# EasyEDA Pro project PicoMiteVGAV1.1.eprj

# Schematic Schematic1
Create Date: 2023-03-16; Page Name: P1; Project Name: PicoMiteVGAV1.1; Schematic Name: Schematic1; Update Date: 2023-06-09; Company: EasyEDA.com; Drawed: Peter Mather; Page Size: A4; Part Number: JLCPCB-002; Reviewed: Peter Mather; Version: V0.1
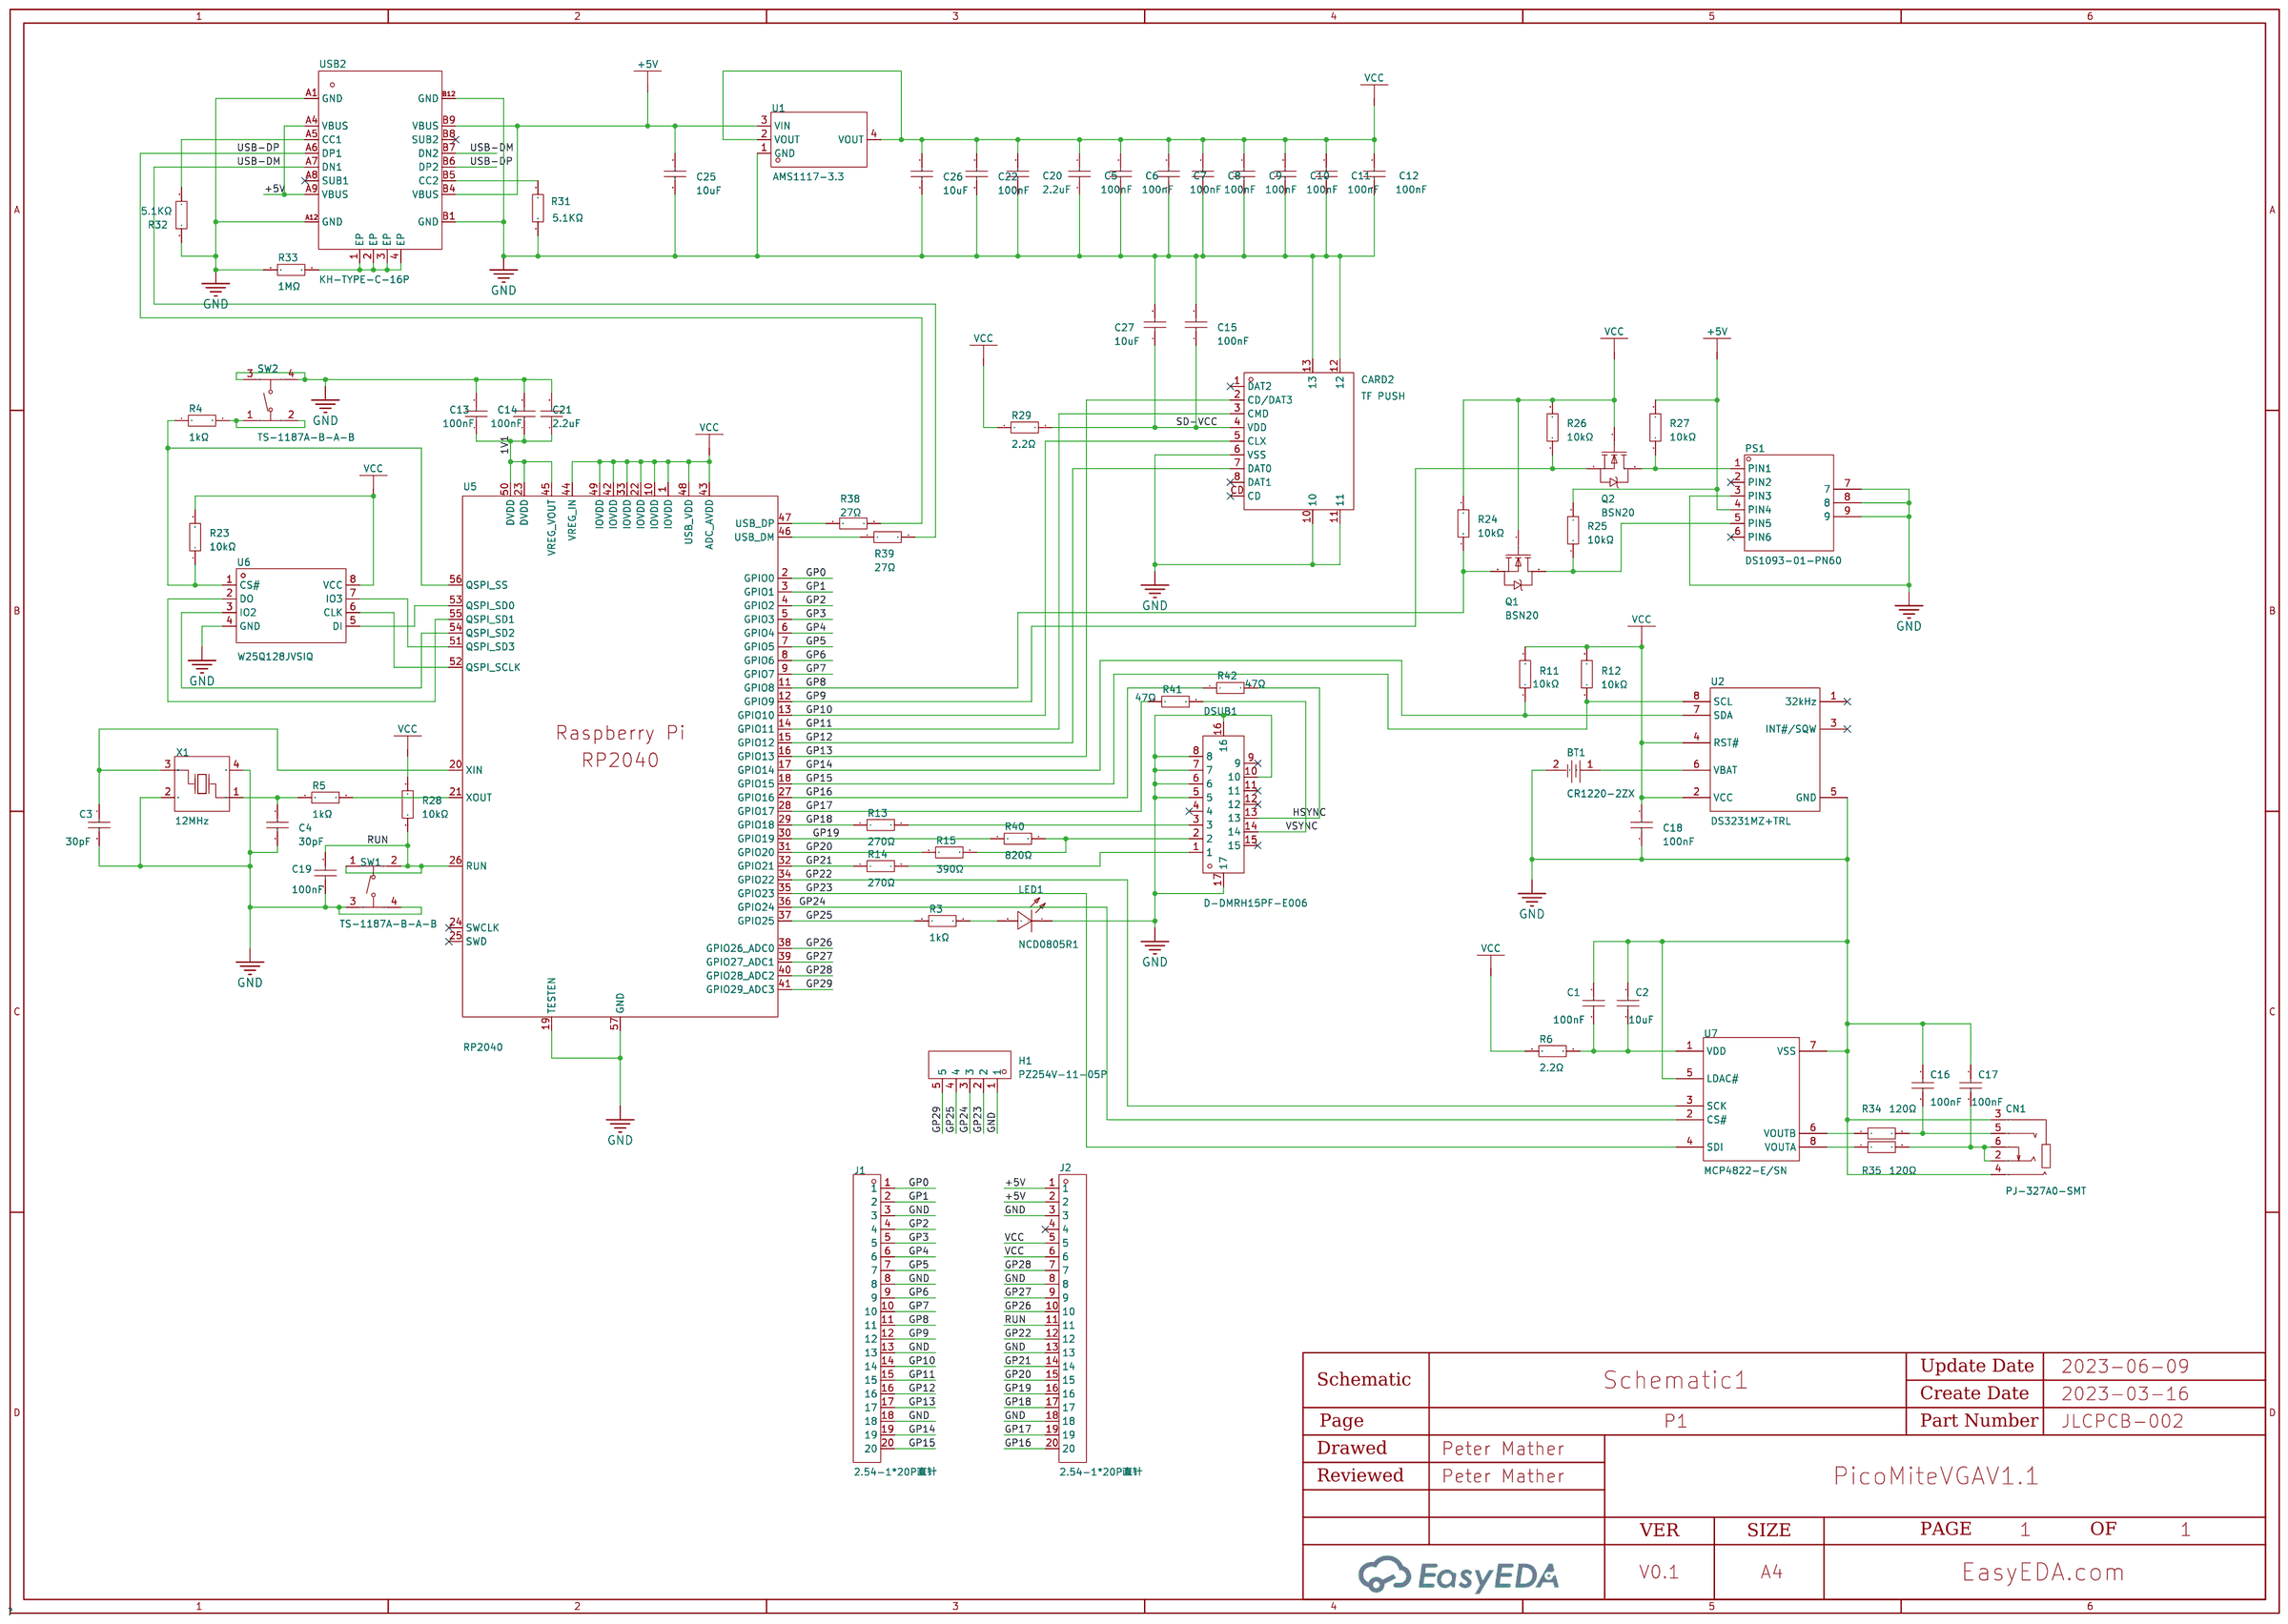
[diagram p0: schematic sheet]

## Parts
BT1  CR1220-2ZX  [BAT-SMD_CR1220-2ZX]
C1  100nF  [C0402_NEW]
C2  10uF  [C1206]
C3  30pF  [C0402]
C4  30pF  [C0402]
C5  100nF  [C0402_NEW]
C6  100nF  [C0402_NEW]
C7  100nF  [C0402_NEW]
C8  100nF  [C0402_NEW]
C9  100nF  [C0402_NEW]
C10  100nF  [C0402_NEW]
C11  100nF  [C0402_NEW]
C12  100nF  [C0402_NEW]
C13  100nF  [C0402_NEW]
C14  100nF  [C0402_NEW]
C15  100nF  [C0402_NEW]
C16  100nF  [C0402_NEW]
C17  100nF  [C0402_NEW]
C18  100nF  [C0402_NEW]
C19  100nF  [C0402_NEW]
C20  2.2uF  [C0603]
C21  2.2uF  [C0603]
C22  100nF  [C0402_NEW]
C25  10uF  [C1206]
C26  10uF  [C1206]
C27  10uF  [C1206]
CARD2  TF PUSH  [TF-SMD_TF-PUSH]
CN1  PJ-327A0-SMT  [AUDIO-SMD_PJ-327A0-SMT]
DSUB1  D-DMRH15PF-E006  [DSUB-TH_15P-P2.29-H-F_DDMRH15PFE006]
H1  PZ254V-11-05P  [HDR-TH_5P-P2.54-V-M]
J1  2.54-1*20P直针  [HDR-TH_20P-P2.54-V-M-1]
J2  2.54-1*20P直针  [HDR-TH_20P-P2.54-V-M-1]
LED1  NCD0805R1  [LED0805-RD]
PS1  DS1093-01-PN60  [CONN-TH_DS1093-01-PN60]
Q1  BSN20  [SOT-23-3_L2.9-W1.6-P1.90-LS2.8-BR]
Q2  BSN20  [SOT-23-3_L2.9-W1.6-P1.90-LS2.8-BR]
R3  1kΩ  [R0603]
R4  1kΩ  [R0603]
R5  1kΩ  [R0603]
R6  2.2Ω  [R0805]
R11  10kΩ  [R0805]
R12  10kΩ  [R0805]
R13  270Ω  [R0603]
R14  270Ω  [R0603]
R15  390Ω  [R0603]
R23  10kΩ  [R0402]
R24  10kΩ  [R0402]
R25  10kΩ  [R0402]
R26  10kΩ  [R0402]
R27  10kΩ  [R0402]
R28  10kΩ  [R0402]
R29  2.2Ω  [R0805]
R31  5.1kΩ  [R0402]
R32  5.1kΩ  [R0402]
R33  1MΩ  [R0402]
R34  120Ω  [R0603]
R35  120Ω  [R0603]
R38  27Ω  [R0603]
R39  27Ω  [R0603]
R40  820Ω  [R0603]
R41  47Ω  [R0805]
R42  47Ω  [R0805]
SW1  TS-1187A-B-A-B  [SW-SMD_4P-L5.1-W5.1-P3.70-LS6.5-TL-2]
SW2  TS-1187A-B-A-B  [SW-SMD_4P-L5.1-W5.1-P3.70-LS6.5-TL-2]
U1  AMS1117-3.3  [SOT-223-3_L6.5-W3.4-P2.30-LS7.0-BR]
U2  DS3231MZ+TRL  [SOIC-8_L4.9-W3.9-P1.27-LS6.0-BL]
U5  RP2040  [LQFN-56_L7.0-W7.0-P0.4-EP]
U6  W25Q128JVSIQ  [SOIC-8_L5.3-W5.3-P1.27-LS8.0-BL]
U7  MCP4822-E/SN  [SOIC-8_L4.9-W3.9-P1.27-LS6.0-BL]
USB2  KH-TYPE-C-16P  [USB-C-SMD_KH-TYPE-C-16P]
X1  12MHz  [OSC-SMD_4P-L3.2-W2.5-BL]

## Library data of the parts
BT1 = CR1220-2ZX: Connector Type:Battery base Battery Type:CR1220 Operating Temperature Range:-25℃~+85℃ Operating Temperature Range:-25℃~+85℃; LCSC Part Name: 电池底座 适用电池:CR1220 自吸; Supplier Part: C969906; Manufacturer: Q&J; Supplier Footprint: SMD; JLCPCB Part Class: Extended Part; Datasheet: https://atta.szlcsc.com/upload/public/pdf/source/20210107/C969906_C1D85B5C66CBBA4D1AEB8467FE1CEC7A.pdf; Supplier: LCSC; Connector Type: Battery base; Battery Type: CR1220; Operating Temperature Range: -25℃~+85℃
C1 C5-C19 C22 = CL05B104KO5NNNC: Capacitance: Tolerance:±10% Tolerance:±10% Voltage Rated: Temperature Coefficient:; LCSC Part Name: 100nF ±10% 16V; Supplier Part: C1525; Manufacturer: SAMSUNG(三星); Supplier Footprint: 0402; JLCPCB Part Class: Basic Part; Datasheet: https://atta.szlcsc.com/upload/public/pdf/source/20160103/1457707674891.pdf; Supplier: LCSC; Tolerance: ±10%
C2 C25-C27 = CL31A106KBHNNNE: Capacitance: Tolerance:±10% Tolerance:±10% Voltage Rated: Temperature Coefficient:; LCSC Part Name: 10uF ±10% 50V; Supplier Part: C13585; Manufacturer: SAMSUNG(三星); Supplier Footprint: 1206; JLCPCB Part Class: Basic Part; Datasheet: https://atta.szlcsc.com/upload/public/pdf/source/20160103/1457707668742.pdf; Supplier: LCSC; Tolerance: ±10%
C3 C4 = 0402CG300J500NT: Capacitance: Tolerance:±5% Tolerance:±5% Voltage Rated: Temperature Coefficient:; LCSC Part Name: 30pF ±5% 50V; Supplier Part: C1570; Manufacturer: FH(风华); Supplier Footprint: 0402; JLCPCB Part Class: Basic Part; Datasheet: https://atta.szlcsc.com/upload/public/pdf/source/20170923/C1570_1506149275948988377.pdf; Supplier: LCSC; Tolerance: ±5%
C20 C21 = CL10A225KO8NNNC: Capacitance: Tolerance:±10% Tolerance:±10% Voltage Rated: Temperature Coefficient:; LCSC Part Name: 2.2uF ±10% 16V; Supplier Part: C23630; Manufacturer: SAMSUNG(三星); Supplier Footprint: 0603; JLCPCB Part Class: Basic Part; Datasheet: https://atta.szlcsc.com/upload/public/pdf/source/20160103/1457707709512.pdf; Supplier: LCSC; Tolerance: ±10%
CARD2 = TF PUSH: Card Type:MicroSD卡(TF卡) Connector Type:卡座 Card Connection Mode:自弹式 Maximum Body Height:2mm Operating Temperature Range:-20℃~+90℃ Operating Temperature Range:-20℃~+90℃; LCSC Part Name: 自弹式TF卡座 TF外焊式内存卡卡座; Supplier Part: C393941; Manufacturer: SHOU HAN(首韩); Supplier Footprint: SMD; JLCPCB Part Class: Extended Part; Datasheet: https://atta.szlcsc.com/upload/public/pdf/source/20191011/C393941_0DDD896EE907FEB750D8B7B8982E2A67.pdf; Supplier: LCSC; Card Type: MicroSD卡(TF卡); Connector Type: 卡座; Card Connection Mode: 自弹式; Maximum Body Height: 2mm; Operating Temperature Range: -20℃~+90℃
CN1 = PJ-327A0-SMT: Connector Type:3.5mm耳机座 Current Rating (Max):0.5A Voltage Rating (Max):30V Operating Temperature Range:-20℃~+70℃ Operating Temperature Range:-20℃~+70℃ Welding Temperature (Max):235℃; LCSC Part Name: 3.5mm耳机座 5P镀金; Supplier Part: C381135; Manufacturer: XKB Connectivity(中国星坤); Supplier Footprint: SMD; JLCPCB Part Class: Extended Part; Datasheet: https://atta.szlcsc.com/upload/public/pdf/source/20211011/16B83D74DCFBFB52BBA1016D248FDA16.pdf; Supplier: LCSC; Connector Type: 3.5mm耳机座; Current Rating (Max): 0.5A; Voltage Rating (Max): 30V; Operating Temperature Range: -20℃~+70℃; Welding Temperature (Max): 235℃
DSUB1 = D-DMRH15PF-E006: Connector Type:D-Sub Gender:Female Number of Pins:15 Number of Rows:3 Mounting Style:Shrouded Current Rating (Max):3A Operating Temperature Range:-50℃~+105℃ Operating Temperature Range:-50℃~+105℃; LCSC Part Name: D-Sub 母 P数:15 HDR半金 铆合锁螺丝 黑胶芯三排; Supplier Part: C379814; Manufacturer: Ckmtw(灿科盟); Supplier Footprint: 插件; JLCPCB Part Class: Extended Part; Datasheet: https://atta.szlcsc.com/upload/public/pdf/source/20190517/C379814_DEECC6016DAC8F179B4364792A838A7A.pdf; Supplier: LCSC; Connector Type: D-Sub; Gender: Female; Number of Pins: 15; Number of Rows: 3; Mounting Style: Shrouded; Current Rating (Max): 3A; Operating Temperature Range: -50℃~+105℃
H1 = PZ254V-11-05P: Number of Rows:单排 Number of Pins:5 Pitch:2.54mm Pin Structure:1x5P Row Spacing:- Mounting Type:Straight Circluar Pins/Square Pins:Square Pins Current Rating (Max):- Voltage Rating (Max):- Length of Mating Pin:6mm Insulation Height:2.5mm Length of End Conn; LCSC Part Name: 2.54mm 1x5P 直插 方针; Supplier Part: C492404; Manufacturer: XFCN(兴飞); Supplier Footprint: 插件,P=2.54mm; JLCPCB Part Class: Extended Part; Datasheet: https://atta.szlcsc.com/upload/public/pdf/source/20200309/C492404_E51533260F8710EFF5D4617281164C1D.pdf; Supplier: LCSC; Number of Rows: 单排; Number of Pins: 5; Pitch: 2.54mm; Pin Structure: 1x5P; Mounting Type: Straight; Circluar Pins/Square Pins: Square Pins; Length of Mating Pin: 6mm; Insulation Height: 2.5mm; Length of End Connection Pin: 3mm; Operating Temperature Range: -40℃~+105℃; Color: Black
J1 J2 = 2.54-1*20P直针: Number of Rows:单排 Number of Pins:20 Pitch:2.54mm Pin Structure:1x20P Row Spacing:- Mounting Type:Straight Circluar Pins/Square Pins:Square Pins Current Rating (Max):3A Voltage Rating (Max):- Length of Mating Pin:- Insulation Height:- Length of End Connect; LCSC Part Name: 2.54mm 1x20P 直插 方针; Supplier Part: C50981; Manufacturer: BOOMELE(博穆精密); Supplier Footprint: 插件,P=2.54mm; JLCPCB Part Class: Extended Part; Datasheet: https://atta.szlcsc.com/upload/public/pdf/source/20151109/1457707571495.pdf; Supplier: LCSC; Number of Rows: 单排; Number of Pins: 20; Pitch: 2.54mm; Pin Structure: 1x20P; Mounting Type: Straight; Circluar Pins/Square Pins: Square Pins; Current Rating (Max): 3A; Operating Temperature Range: -40℃~+105℃; Color: Black
LED1 = NCD0805R1_C84256: Emitted Color:红灯; LCSC Part Name: 红灯; Supplier Part: C84256; Manufacturer: 国星光电; Supplier Footprint: 0805; JLCPCB Part Class: Basic Part; Datasheet: https://atta.szlcsc.com/upload/public/pdf/source/20200820/C84256_F0A75A43B3EAD75808600A0514C76B99.pdf; Supplier: LCSC; Emitted Color: 红灯
PS1 = DS1093-01-PN60: Number of Pins:6 Gender:Female Level of Protection:- Current Rating (Max):1A Operating Temperature Range:-40℃~+105℃ Operating Temperature Range:-40℃~+105℃; LCSC Part Name: PS2鼠标插座 6Pin  紫色; Supplier Part: C77848; Manufacturer: CONNFLY; Supplier Footprint: 插件; JLCPCB Part Class: Extended Part; Datasheet: https://atta.szlcsc.com/upload/public/pdf/source/20160816/1471343007546.pdf; Supplier: LCSC; Number of Pins: 6; Gender: Female; Current Rating (Max): 1A; Operating Temperature Range: -40℃~+105℃
Q1 Q2 = BSN20_C116157: Type: Drain Source Voltage (Vdss): Continuous Drain Current (Id): Power Dissipation (Pd):- Drain Source On Resistance (RDS(on)@Vgs,Id):3.5Ω@5V,200mA Gate Threshold Voltage (Vgs(th)@Id):1.5V@1mA; LCSC Part Name: N沟道 50V 100mA; Supplier Part: C116157; Manufacturer: SHIKUES(时科); Supplier Footprint: SOT-23-3L; JLCPCB Part Class: Extended Part; Datasheet: https://atta.szlcsc.com/upload/public/pdf/source/20170721/C116157_1500622630262834583.pdf; Supplier: LCSC; Drain Source On Resistance (RDS(on)@Vgs,Id): 3.5Ω@5V,200mA; Gate Threshold Voltage (Vgs(th)@Id): 1.5V@1mA
R3-R5 = 0603WAF1001T5E: Type:Thick Film Resistors Resistance: Tolerance:±1% Tolerance:±1% Power(Watts): Temperature Coefficient:±100ppm/℃ Temperature Coefficient:±100ppm/℃ Overload Voltage (Max): Operating Temperature Range:-55℃~+155℃ Operating Temperature Range:-55℃~+155℃; LCSC Part Name: 1kΩ ±1% 100mW; Supplier Part: C21190; Manufacturer: UNI-ROYAL(厚声); Supplier Footprint: 0603; JLCPCB Part Class: Basic Part; Datasheet: https://atta.szlcsc.com/upload/public/pdf/source/20200306/C422600_1E6D84923E4A46A82E41ADD87F860B5C.pdf; Supplier: LCSC; Type: Thick Film Resistors; Tolerance: ±1%; Temperature Coefficient: ±100ppm/℃; Operating Temperature Range: -55℃~+155℃
R6 R29 = 0805W8F220KT5E: LCSC Part Name: 2.2Ω(2R20) ±1% 编带; Supplier Part: C17521; Manufacturer: UNI-ROYAL(厚声); Supplier Footprint: 0805; JLCPCB Part Class: Basic Part; Datasheet: https://atta.szlcsc.com/upload/public/pdf/source/20170920/C17521_1505887118343979880.pdf; Supplier: LCSC
R11 R12 = 0805W8F1002T5E: Type:Thick Film Resistors Resistance: Tolerance:±1% Tolerance:±1% Power(Watts): Temperature Coefficient:±100ppm/℃ Temperature Coefficient:±100ppm/℃ Overload Voltage (Max): Operating Temperature Range:-55℃~+155℃ Operating Temperature Range:-55℃~+155℃; LCSC Part Name: 10kΩ ±1% 125mW; Supplier Part: C17414; Manufacturer: UNI-ROYAL(厚声); Supplier Footprint: 0805; JLCPCB Part Class: Basic Part; Datasheet: https://atta.szlcsc.com/upload/public/pdf/source/20200306/C422600_1E6D84923E4A46A82E41ADD87F860B5C.pdf; Supplier: LCSC; Type: Thick Film Resistors; Tolerance: ±1%; Temperature Coefficient: ±100ppm/℃; Operating Temperature Range: -55℃~+155℃
R13 R14 = 0603WAF2700T5E: Type:Thick Film Resistors Resistance: Tolerance:±1% Tolerance:±1% Power(Watts): Temperature Coefficient:±100ppm/℃ Temperature Coefficient:±100ppm/℃ Overload Voltage (Max): Operating Temperature Range:-55℃~+155℃ Operating Temperature Range:-55℃~+155℃; LCSC Part Name: 270Ω ±1% 100mW; Supplier Part: C22966; Manufacturer: UNI-ROYAL(厚声); Supplier Footprint: 0603; JLCPCB Part Class: Basic Part; Datasheet: https://atta.szlcsc.com/upload/public/pdf/source/20200306/C422600_1E6D84923E4A46A82E41ADD87F860B5C.pdf; Supplier: LCSC; Type: Thick Film Resistors; Tolerance: ±1%; Temperature Coefficient: ±100ppm/℃; Operating Temperature Range: -55℃~+155℃
R15 = 0603WAF3900T5E: Tolerance: Temperature Coefficient: Temperature Coefficient: Power(Watts): Resistance: Overload Voltage (Max): Operating Temperature Range: Operating Temperature Range:; LCSC Part Name: 390Ω ±1%; Supplier Part: C23151; Manufacturer: UNI-ROYAL(厚声); Supplier Footprint: 0603; JLCPCB Part Class: Basic Part; Datasheet: https://atta.szlcsc.com/upload/public/pdf/source/20170920/C23151_1505901103965982535.pdf; Supplier: LCSC
R23-R28 = 0402WGF1002TCE: Type:Thick Film Resistors Resistance: Tolerance:±1% Tolerance:±1% Power(Watts): Temperature Coefficient:±100ppm/℃ Temperature Coefficient:±100ppm/℃ Overload Voltage (Max): Operating Temperature Range:-55℃~+155℃ Operating Temperature Range:-55℃~+155℃; LCSC Part Name: 10kΩ ±1% 62.5mW; Supplier Part: C25744; Manufacturer: UNI-ROYAL(厚声); Supplier Footprint: 0402; JLCPCB Part Class: Basic Part; Datasheet: https://atta.szlcsc.com/upload/public/pdf/source/20200306/C422600_1E6D84923E4A46A82E41ADD87F860B5C.pdf; Supplier: LCSC; Type: Thick Film Resistors; Tolerance: ±1%; Temperature Coefficient: ±100ppm/℃; Operating Temperature Range: -55℃~+155℃
R31 R32 = 0402WGF5101TCE: Type:Thick Film Resistors Resistance: Tolerance:±1% Tolerance:±1% Power(Watts): Temperature Coefficient:±100ppm/℃ Temperature Coefficient:±100ppm/℃ Overload Voltage (Max): Operating Temperature Range:-55℃~+155℃ Operating Temperature Range:-55℃~+155℃; LCSC Part Name: 5.1KΩ(5101) ±1% 编带; Supplier Part: C25905; Manufacturer: UNI-ROYAL(厚声); Manufacturer Part: 5.1KΩ; Supplier Footprint: 0402; JLCPCB Part Class: Basic Part; Datasheet: https://atta.szlcsc.com/upload/public/pdf/source/20170920/C25905_1505895107382980911.pdf; Supplier: LCSC; Type: Thick Film Resistors; Tolerance: ±1%; Temperature Coefficient: ±100ppm/℃; Operating Temperature Range: -55℃~+155℃
R33 = 0402WGF1004TCE: Type:Thick Film Resistors Resistance: Tolerance:±1% Tolerance:±1% Power(Watts): Temperature Coefficient:±100ppm/℃ Temperature Coefficient:±100ppm/℃ Overload Voltage (Max): Operating Temperature Range:-55℃~+155℃ Operating Temperature Range:-55℃~+155℃; LCSC Part Name: 1MΩ ±1% 62.5mW; Supplier Part: C26083; Manufacturer: UNI-ROYAL(厚声); Supplier Footprint: 0402; JLCPCB Part Class: Basic Part; Datasheet: https://atta.szlcsc.com/upload/public/pdf/source/20200306/C422600_1E6D84923E4A46A82E41ADD87F860B5C.pdf; Supplier: LCSC; Type: Thick Film Resistors; Tolerance: ±1%; Temperature Coefficient: ±100ppm/℃; Operating Temperature Range: -55℃~+155℃
R34 R35 = 0603WAF1200T5E: Type:Thick Film Resistors Resistance: Tolerance:±1% Tolerance:±1% Power(Watts): Temperature Coefficient:±100ppm/℃ Temperature Coefficient:±100ppm/℃ Overload Voltage (Max): Operating Temperature Range:-55℃~+155℃ Operating Temperature Range:-55℃~+155℃; LCSC Part Name: 120Ω ±1% 100mW; Supplier Part: C22787; Manufacturer: UNI-ROYAL(厚声); Supplier Footprint: 0603; JLCPCB Part Class: Basic Part; Datasheet: https://atta.szlcsc.com/upload/public/pdf/source/20200306/C422600_1E6D84923E4A46A82E41ADD87F860B5C.pdf; Supplier: LCSC; Type: Thick Film Resistors; Tolerance: ±1%; Temperature Coefficient: ±100ppm/℃; Operating Temperature Range: -55℃~+155℃
R38 R39 = 0603WAF270JT5E: Type:Thick Film Resistors Resistance: Tolerance:±1% Tolerance:±1% Power(Watts): Temperature Coefficient:±200ppm/℃ Temperature Coefficient:±200ppm/℃ Overload Voltage (Max): Operating Temperature Range:-55℃~+155℃ Operating Temperature Range:-55℃~+155℃; LCSC Part Name: 27Ω ±1% 100mW; Supplier Part: C25190; Manufacturer: UNI-ROYAL(厚声); Supplier Footprint: 0603; JLCPCB Part Class: Basic Part; Datasheet: https://atta.szlcsc.com/upload/public/pdf/source/20200306/C422600_1E6D84923E4A46A82E41ADD87F860B5C.pdf; Supplier: LCSC; Type: Thick Film Resistors; Tolerance: ±1%; Temperature Coefficient: ±200ppm/℃; Operating Temperature Range: -55℃~+155℃
R40 = 0603WAF8200T5E: Type:Thick Film Resistors Resistance: Tolerance:±1% Tolerance:±1% Power(Watts): Temperature Coefficient:±100ppm/℃ Temperature Coefficient:±100ppm/℃ Overload Voltage (Max): Operating Temperature Range:-55℃~+155℃ Operating Temperature Range:-55℃~+155℃; LCSC Part Name: 820Ω ±1% 100mW; Supplier Part: C23253; Manufacturer: UNI-ROYAL(厚声); Supplier Footprint: 0603; JLCPCB Part Class: Basic Part; Datasheet: https://atta.szlcsc.com/upload/public/pdf/source/20200306/C422600_1E6D84923E4A46A82E41ADD87F860B5C.pdf; Supplier: LCSC; Type: Thick Film Resistors; Tolerance: ±1%; Temperature Coefficient: ±100ppm/℃; Operating Temperature Range: -55℃~+155℃
R41 R42 = 0805W8F470JT5E: Type:Thick Film Resistors Resistance: Tolerance:±1% Tolerance:±1% Power(Watts): Temperature Coefficient:±200ppm/℃ Temperature Coefficient:±200ppm/℃ Overload Voltage (Max): Operating Temperature Range:-55℃~+155℃ Operating Temperature Range:-55℃~+155℃; LCSC Part Name: 47Ω ±1% 125mW; Supplier Part: C17714; Manufacturer: UNI-ROYAL(厚声); Supplier Footprint: 0805; JLCPCB Part Class: Basic Part; Datasheet: https://atta.szlcsc.com/upload/public/pdf/source/20200306/C422600_1E6D84923E4A46A82E41ADD87F860B5C.pdf; Supplier: LCSC; Type: Thick Film Resistors; Tolerance: ±1%; Temperature Coefficient: ±200ppm/℃; Operating Temperature Range: -55℃~+155℃
SW1 SW2 = TS-1187A-B-A-B: Contact Current:50mA Voltage Rating (DC):12V Insulation Resistance:- Circuit:SPST Mounting Style:Brick nogging Actuator Style:Round Button Actuator/Cap Color:金色 With Lamp:No Operating Force:160gf Mechanical Life:100000 Operating Temperature:-30℃~+85℃ Oper; LCSC Part Name: 5.1*5.1*1.5 防水金属头160gf; Supplier Part: C318884; Manufacturer: XKB Connectivity(中国星坤); Supplier Footprint: SMD; JLCPCB Part Class: Basic Part; Datasheet: https://atta.szlcsc.com/upload/public/pdf/source/20200227/C318884_1F20165719E1C4CAA3E10C4C359C6E26.pdf; Supplier: LCSC; Contact Current: 50mA; Voltage Rating (DC): 12V; Circuit: SPST; Mounting Style: Brick nogging; Actuator Style: Round Button; Actuator/Cap Color: 金色; With Lamp: No; Operating Force: 160gf; Mechanical Life: 100000; Operating Temperature: -30℃~+85℃; Switch Length: 5.1mm; Switch Width: 5.1mm; Switch Height: 1.5mm; Strike Gundam: NO
U1 = AMS1117-3.3_C6186: Output Type: Output Polarity:Positive Number of Outputs:1 Maximum Input Voltage:- Output Voltage:3.3V~3.3V Output Voltage:3.3V~3.3V Dropout Voltage:1.3V@(800mA) Quiescent Current (Ground Current):- Output Current:1A Power Supply Rejection Ratio (PSRR):72d; LCSC Part Name: 正 Vout=3.3V 1A 72dB@(120Hz); Supplier Part: C6186; Manufacturer: AMS; Supplier Footprint: SOT-223-3; JLCPCB Part Class: Basic Part; Datasheet: https://atta.szlcsc.com/upload/public/pdf/source/20180727/C6186_7A095716F0823C02F1997A905E26C086.pdf; Supplier: LCSC; Output Polarity: Positive; Number of Outputs: 1; Output Voltage: 3.3V~3.3V; Dropout Voltage: 1.3V@(800mA); Output Current: 1A; Power Supply Rejection Ratio (PSRR): 72dB@(120Hz)
U2 = DS3231MZ+TRL: LCSC Part Name: DS3231MZRL; Supplier Part: C107410; Manufacturer: MAXIM(美信); Supplier Footprint: SOIC-8-150mil; JLCPCB Part Class: Extended Part; Datasheet: https://atta.szlcsc.com/upload/public/pdf/source/20170620/1497944726830.pdf; Supplier: LCSC
U5 = RP2040_C2040: CPU Core:ARM Cortex-M0 CPU Maximum Speed:133MHz Operating Voltage Range:- Operating Voltage Range:- Program Storage Size:- Program Memory Type:- RAM Size:264KB EEPROM:- GPIO Ports Number:30 ADC (Bit):12bit DAC (Bit):- PWM (Bit):- 8Bit Timer:- 16Bit Timer:; LCSC Part Name: ARM Cortex-M0 133MHz; Supplier Part: C2040; Manufacturer: Raspberry Pi(树莓派); Supplier Footprint: LQFN-56(7x7); JLCPCB Part Class: Extended Part; Datasheet: https://atta.szlcsc.com/upload/public/pdf/source/20210621/C2040_96F425825606B7957D87DD32E2512CA9.pdf; Supplier: LCSC; CPU Core: ARM Cortex-M0; CPU Maximum Speed: 133MHz; RAM Size: 264KB; GPIO Ports Number: 30; ADC (Bit): 12bit; UART/USART: 2; I2C: 2; SPI: 2; Universal Serial Bus: 有; Peripheral/Function: DMA；PWM; Direct Memory Access: 有
U6 = W25Q128JVSIQ: Supplier Part: C97521; Manufacturer: WINBOND(华邦); Supplier Footprint: SOIC-8-208mil; JLCPCB Part Class: Basic Part; Datasheet: https://atta.szlcsc.com/upload/public/pdf/source/20170316/1489627409956.pdf; Supplier: LCSC
U7 = MCP4822-E/SN: Supplier Part: C16040; Manufacturer: MICROCHIP(美国微芯); Supplier Footprint: SOIC-8; JLCPCB Part Class: Extended Part; Datasheet: https://atta.szlcsc.com/upload/public/pdf/source/20140724/1457707160793.pdf; Supplier: LCSC
USB2 = KH-TYPE-C-16P: Connector Type:Type-C Standard:- Gender:Female Number of Contacts:16 Number of Ports:1 Mounting Style:Surface Mount Current Rating - Power (Max):3A Operating Temperature Range:-40℃~+85℃ Operating Temperature Range:-40℃~+85℃; LCSC Part Name: Type-C 母座 卧贴; Supplier Part: C709357; Manufacturer: kinghelm(金航标); Supplier Footprint: SMD; JLCPCB Part Class: Extended Part; Datasheet: https://atta.szlcsc.com/upload/public/pdf/source/20200911/C709357_AA8DCEB38BB20E3035A7ED7AE7667837.pdf; Supplier: LCSC; Connector Type: Type-C; Gender: Female; Number of Contacts: 16; Number of Ports: 1; Mounting Style: Surface Mount; Current Rating - Power (Max): 3A; Operating Temperature Range: -40℃~+85℃
X1 = X322512MSB4SI: Crystal Type:SMD Crystal Resonator Frequency: Frequency Tolerance:±10ppm Frequency Tolerance:±10ppm Frequency Stability:±30ppm Frequency Stability:±30ppm Load Capacitance: Operating Temperature: Operating Temperature:; LCSC Part Name: 12MHz ±10ppm 20pF; Supplier Part: C9002; Manufacturer: YXC(扬兴晶振); Supplier Footprint: SMD3225-4P; JLCPCB Part Class: Basic Part; Datasheet: https://atta.szlcsc.com/upload/public/pdf/source/20210329/C112971_1F611BDC486E193C1706F6D8EB5AA189.pdf; Supplier: LCSC; Crystal Type: SMD Crystal Resonator; Frequency Tolerance: ±10ppm; Frequency Stability: ±30ppm

## Nets
1V1: C13.1 C14.1 C21.1 U5.23(DVDD) U5.45(VREG_VOUT) U5.50(DVDD)
+5V: C25.2 J2.1 J2.2 PS1.4(PIN4) R25.2 R27.2 U1.3(VIN) USB2.A4(VBUS) USB2.A9(VBUS) USB2.B4(VBUS) USB2.B9(VBUS)
GND: BT1.2 C1.2 C2.2 C3.1 C4.1 C5.1 C6.1 C7.1 C8.1 C9.1 C10.1 C11.1 C12.1 C13.2 C14.2 C15.2 C16.2 C17.2 C18.1 C19.1 C20.1 C21.2 C22.1 C25.1 C26.1 C27.2 CARD2.6(VSS) CARD2.10 CARD2.11 CARD2.12 CARD2.13 CN1.3 CN1.4 DSUB1.5 DSUB1.6 DSUB1.7 DSUB1.8 DSUB1.10 DSUB1.16 DSUB1.17 H1.1 J1.3 J1.8 J1.13 J1.18 J2.3 J2.8 J2.13 J2.18 LED1.1(-) PS1.3(PIN3) PS1.7 PS1.8 PS1.9 R31.1 R32.1 R33.1 SW1.3(C) SW1.4(D) SW2.3(C) SW2.4(D) U1.1(GND) U2.5(GND) U5.19(TESTEN) U5.57(GND) U6.4(GND) U7.5(LDAC#) U7.7(VSS) USB2.A1(GND) USB2.A12(GND) USB2.B1(GND) USB2.B12(GND) X1.2(GND) X1.4(GND)
VCC: C5.2 C6.2 C7.2 C8.2 C9.2 C10.2 C11.2 C12.2 C18.2 C20.2 C22.2 C26.2 J2.5 J2.6 Q1.1(G) Q2.1(G) R6.1 R11.2 R12.2 R23.2 R24.2 R26.2 R28.2 R29.1 U1.2(VOUT) U1.4(VOUT) U2.2(VCC) U2.4(RST#) U5.1(IOVDD) U5.10(IOVDD) U5.22(IOVDD) U5.33(IOVDD) U5.42(IOVDD) U5.43(ADC_AVDD) U5.44(VREG_IN) U5.48(USB_VDD) U5.49(IOVDD) U6.8(VCC)
GP0: J1.1 U5.2(GPIO0)
GP1: J1.2 U5.3(GPIO1)
GP2: J1.4 U5.4(GPIO2)
GP3: J1.5 U5.5(GPIO3)
GP4: J1.6 U5.6(GPIO4)
GP5: J1.7 U5.7(GPIO5)
GP6: J1.9 U5.8(GPIO6)
GP7: J1.10 U5.9(GPIO7)
GP8: J1.11 Q1.2(S) R24.1 U5.11(GPIO8)
GP9: J1.12 Q2.2(S) R26.1 U5.12(GPIO9)
GP10: CARD2.5(CLX) J1.14 U5.13(GPIO10)
GP11: CARD2.3(CMD) J1.15 U5.14(GPIO11)
GP12: CARD2.7(DAT0) J1.16 U5.15(GPIO12)
GP13: CARD2.2(CD/DAT3) J1.17 U5.16(GPIO13)
GP14: J1.19 R11.1 U2.7(SDA) U5.17(GPIO14)
GP15: J1.20 R12.1 U2.8(SCL) U5.18(GPIO15)
GP16: J2.20 R42.1 U5.27(GPIO16)
GP17: J2.19 R41.1 U5.28(GPIO17)
GP18: J2.17 R13.1 U5.29(GPIO18)
GP19: J2.16 R40.1 U5.30(GPIO19)
GP20: J2.15 R15.1 U5.31(GPIO20)
GP21: J2.14 R14.1 U5.32(GPIO21)
GP22: J2.12 U5.34(GPIO22) U7.3(SCK)
GP23: H1.2 U5.35(GPIO23) U7.4(SDI)
GP24: H1.3 U5.36(GPIO24) U7.2(CS#)
GP25: H1.4 R3.1 U5.37(GPIO25)
GP26: J2.10 U5.38(GPIO26_ADC0)
GP27: J2.9 U5.39(GPIO27_ADC1)
GP28: J2.7 U5.40(GPIO28_ADC2)
GP29: H1.5 U5.41(GPIO29_ADC3)
HSYNC: DSUB1.13 R42.2
RUN: C19.2 J2.11 R28.1 SW1.1(A) SW1.2(B) U5.26(RUN)
SD-VCC: C15.1 C27.1 CARD2.4(VDD) R29.2
USB-DM: R39.2 USB2.A7(DN1) USB2.B7(DN2)
USB-DP: R38.2 USB2.A6(DP1) USB2.B6(DP2)
VSYNC: DSUB1.14 R41.2
$1N15506: R39.1 U5.46(USB_DM)
$1N15528: R38.1 U5.47(USB_DP)
$1N16226: DSUB1.2 R15.2 R40.2
$1N16303: DSUB1.3 R13.2
$1N16324: DSUB1.1 R14.2
$1N17160: U5.52(QSPI_SCLK) U6.6(CLK)
$1N17190: U5.51(QSPI_SD3) U6.7(IO3)
$1N17220: U5.54(QSPI_SD2) U6.3(IO2)
$1N17286: U5.55(QSPI_SD1) U6.2(DO)
$1N17350: R4.1 R23.1 U5.56(QSPI_SS) U6.1(CS#)
$1N17556: U5.53(QSPI_SD0) U6.5(DI)
$1N17761: R5.2 U5.21(XOUT)
$1N17798: C4.2 R5.1 X1.1(OSC1)
$1N18648: C3.2 U5.20(XIN) X1.3(OSC2)
$1N19413: R4.2 SW2.1(A) SW2.2(B)
$1N20967: PS1.1(PIN1) Q2.3(D) R27.1
$1N21008: PS1.5(PIN5) Q1.3(D) R25.1
$1N25166: LED1.2(+) R3.2
$1N34038: BT1.1 U2.6(VBAT)
$1N89274: R31.2 USB2.B5(CC2)
$1N89558: R32.2 USB2.A5(CC1)
$1N90266: R33.2 USB2.1(EP) USB2.2(EP) USB2.3(EP) USB2.4(EP)
$1N147884: C1.1 C2.1 R6.2 U7.1(VDD)
$1N151381: R34.1 U7.6(VOUTB)
$1N151496: R35.1 U7.8(VOUTA)
$1N151611: C16.1 CN1.5 R34.2
$1N151726: C17.1 CN1.2 CN1.6 R35.2

Not connected (* = marked no-connect by the designer): CARD2 1(DAT2)* 8(DAT1)* CD*; DSUB1 4* 9* 11* 12* 15*; J2 4*; PS1 2(PIN2)* 6(PIN6)*; U2 1(32kHz)* 3(INT#/SQW)*; U5 24(SWCLK)* 25(SWD)*; USB2 A8(SUB1)* B8(SUB2)*

# Board PCB3
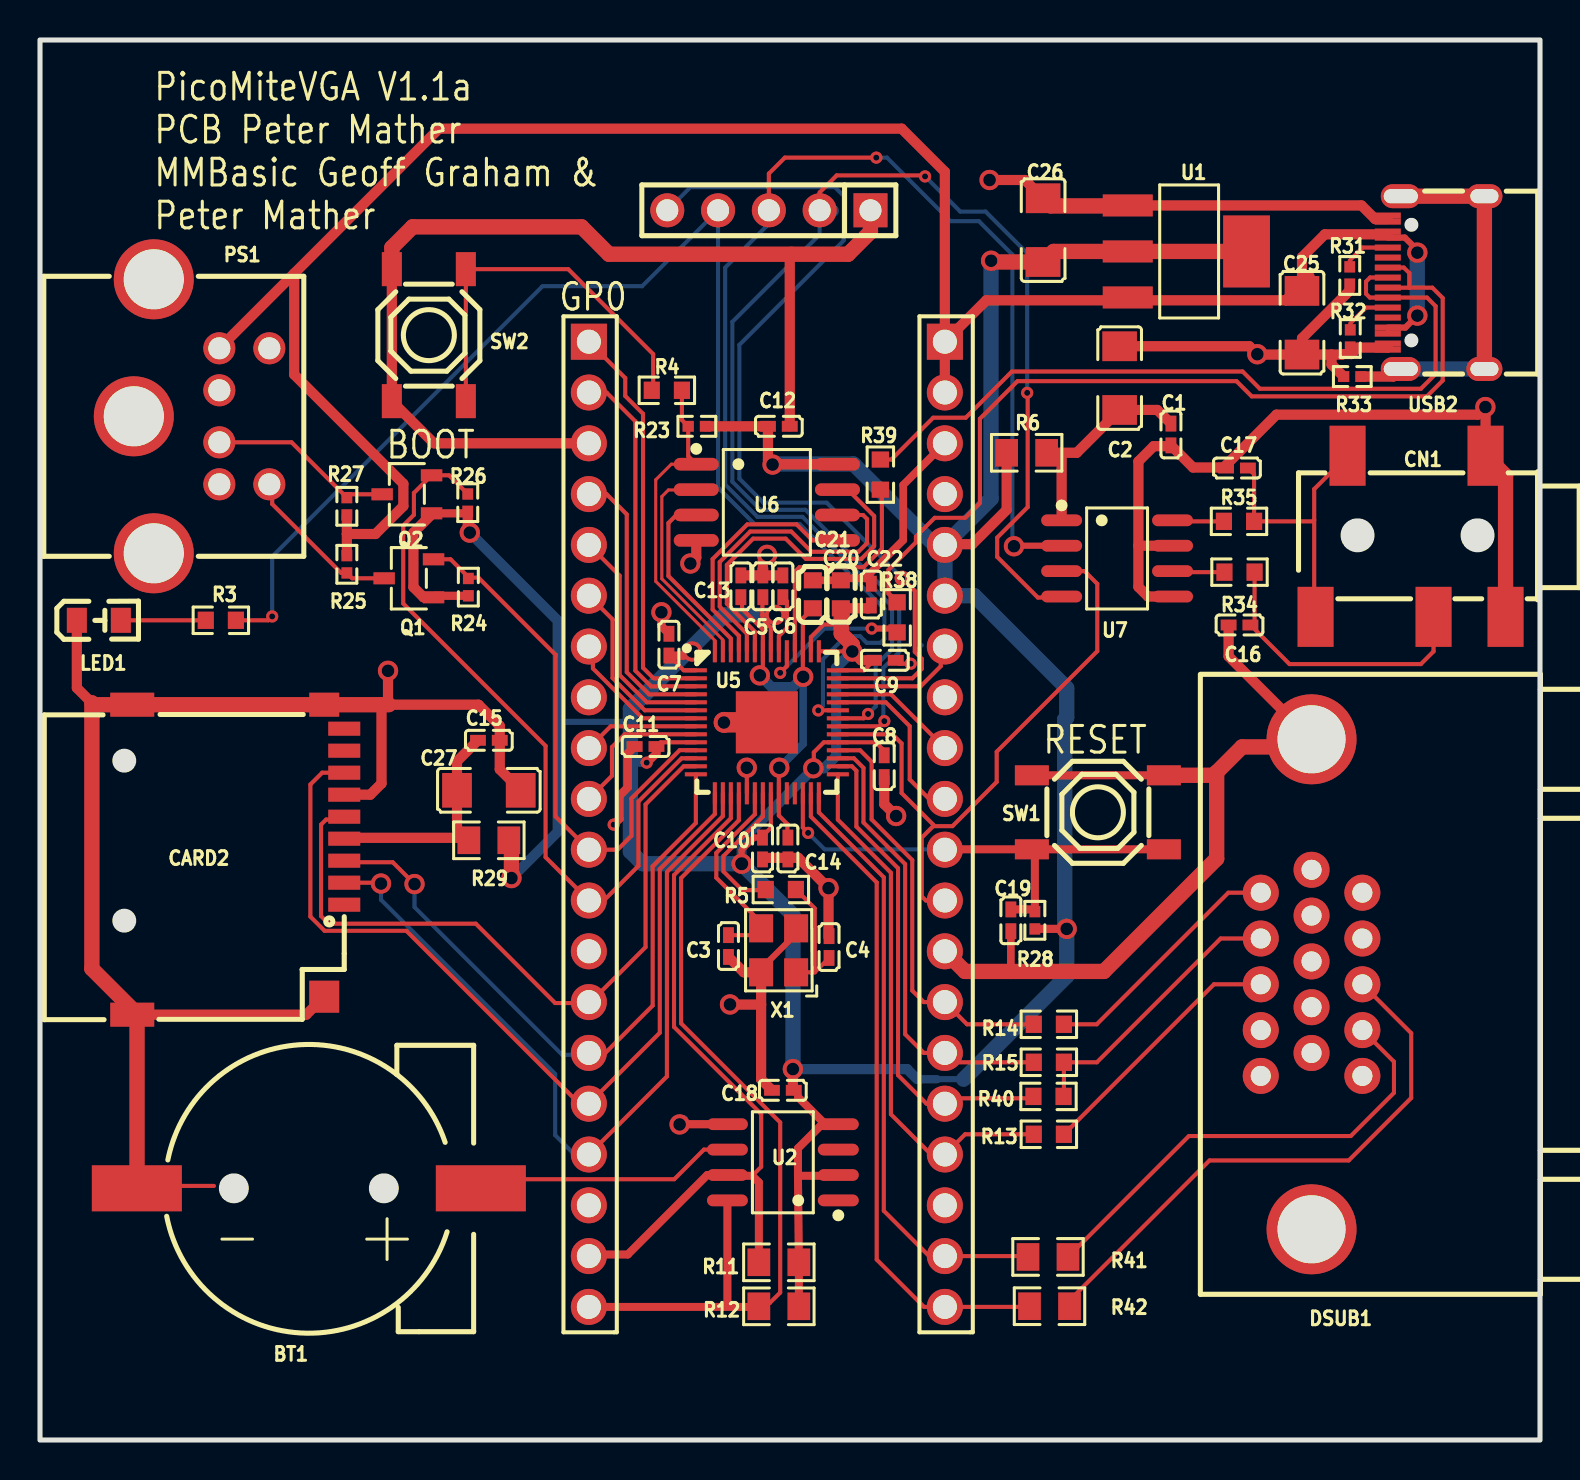
[diagram p1: board, top side]
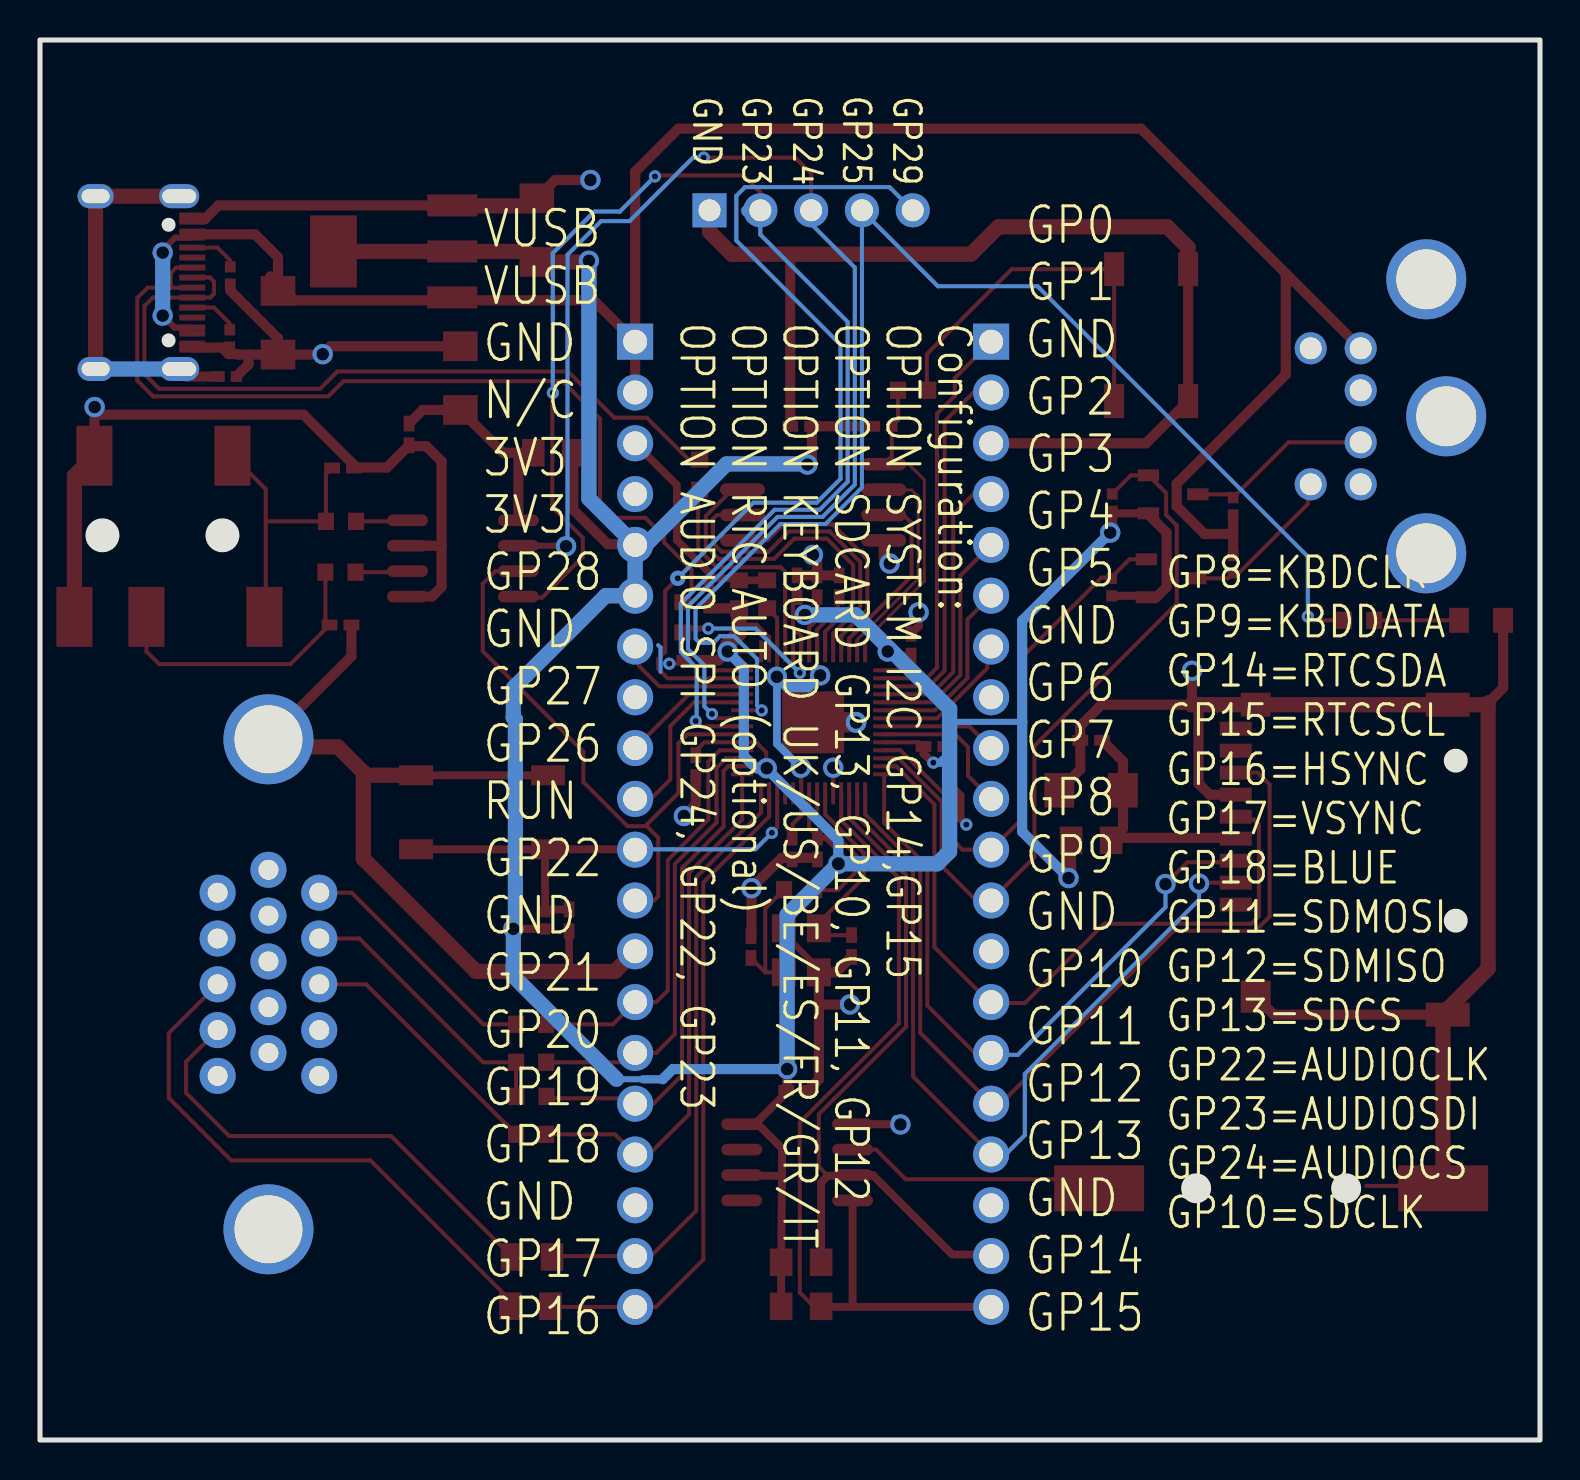
[diagram p2: board, bottom side, seen from below]

Outline 75 x 70 mm; copper layers: Top Layer, Bottom Layer. Coordinates in mm from the lower left corner of the outline.
Outline path: rectangle 75,0 0,70
Stack: Top Layer 0.035mm / Dielectric1 1.51mm FR4 er 4.5 / Bottom Layer 0.035mm

## Design rules (mm)
spacing safeClearance (default): track to track 0.152, other pairs 0.152 to 0.3
track width trackWidth (default): min 0.127, default 0.254, max 2.54
differential pair differentialPair (default): width min 0.127, default 0.254, max 2.54; gap min 0.152, default 0.152
via viaSize (default): diameter min 0.5, default 0.61, max 10; hole min 0.3, default 0.305, max 6

## Placement (name value [footprint] x y rotation side)
BT1  CR1220-2ZX  [BAT-SMD_CR1220-2ZX]  13.44 12.58 180 top
C1  100nF  [C0402_NEW]  56.55 50.28 270 top
C2  10uF  [C1206]  53.98 53.09 90 top
C3  30pF  [C0402]  34.42 24.7 90 top
C4  30pF  [C0402]  39.45 24.65 270 top
C5  100nF  [C0402_NEW]  36.14 42.68 270 top
C6  100nF  [C0402_NEW]  37.14 42.68 270 top
C7  100nF  [C0402_NEW]  31.45 39.77 270 top
C8  100nF  [C0402_NEW]  42.21 33.69 90 top
C9  100nF  [C0402_NEW]  42.24 38.98 180 top
C10  100nF  [C0402_NEW]  36.12 29.57 90 top
C11  100nF  [C0402_NEW]  30.28 34.67 0 top
C12  100nF  [C0402_NEW]  36.94 50.68 180 top
C13  100nF  [C0402_NEW]  35.04 42.68 90 top
C14  100nF  [C0402_NEW]  37.39 29.57 270 top
C15  100nF  [C0402_NEW]  22.44 34.98 0 top
C16  100nF  [C0402_NEW]  59.98 40.75 180 top
C17  100nF  [C0402_NEW]  59.85 48.6 180 top
C18  100nF  [C0402_NEW]  37.14 17.48 0 top
C19  100nF  [C0402_NEW]  48.54 25.98 90 top
C20  2.2uF  [C0603]  40.04 42.28 270 top
C21  2.2uF  [C0603]  38.64 42.28 90 top
C22  100nF  [C0402_NEW]  41.57 42.27 270 top
C25  10uF  [C1206]  63.1 55.86 90 top
C26  10uF  [C1206]  50.16 60.49 270 top
C27  10uF  [C1206]  22.44 32.48 0 top
CARD2  TF PUSH  [TF-SMD_TF-PUSH]  9.91 29.02 270 top
CN1  PJ-327A0-SMT  [AUDIO-SMD_PJ-327A0-SMT]  68.53 45.18 180 top
DSUB1  D-DMRH15PF-E006  [DSUB-TH_15P-P2.29-H-F_DDMRH15PFE006]  63.58 22.78 90 top
H1  PZ254V-11-05P  [HDR-TH_5P-P2.54-V-M]  36.44 61.48 180 top
J1  2.54-1*20P直针  [HDR-TH_20P-P2.54-V-M-1]  27.44 30.78 270 top
J2  2.54-1*20P直针  [HDR-TH_20P-P2.54-V-M-1]  45.24 30.78 270 top
LED1  NCD0805R1  [LED0805-RD]  2.94 40.98 0 top
PS1  DS1093-01-PN60  [CONN-TH_DS1093-01-PN60]  8.08 51.18 270 top
Q1  BSN20  [SOT-23-3_L2.9-W1.6-P1.90-LS2.8-BR]  18.44 43.08 0 top
Q2  BSN20  [SOT-23-3_L2.9-W1.6-P1.90-LS2.8-BR]  18.34 47.28 0 top
R3  1kΩ  [R0603]  9.04 40.98 180 top
R4  1kΩ  [R0603]  31.34 52.48 180 top
R5  1kΩ  [R0603]  37.04 27.52 180 top
R6  2.2Ω  [R0805]  49.33 49.36 0 top
R11  10kΩ  [R0805]  36.94 8.88 0 top
R12  10kΩ  [R0805]  36.94 6.69 0 top
R13  270Ω  [R0603]  50.44 15.28 0 top
R14  270Ω  [R0603]  50.44 20.78 0 top
R15  390Ω  [R0603]  50.44 18.88 0 top
R23  10kΩ  [R0402]  32.84 50.68 0 top
R24  10kΩ  [R0402]  21.42 42.64 270 top
R25  10kΩ  [R0402]  15.34 43.78 90 top
R26  10kΩ  [R0402]  21.39 46.87 270 top
R27  10kΩ  [R0402]  15.34 46.68 270 top
R28  10kΩ  [R0402]  49.74 25.98 270 top
R29  2.2Ω  [R0805]  22.44 29.98 180 top
R31  5.1kΩ  [R0402]  65.49 58.23 90 top
R32  5.1kΩ  [R0402]  65.51 55.08 90 top
R33  1MΩ  [R0402]  65.61 53.17 0 top
R34  120Ω  [R0603]  59.98 43.39 0 top
R35  120Ω  [R0603]  59.95 45.93 0 top
R38  27Ω  [R0603]  42.86 41.13 90 top
R39  27Ω  [R0603]  42.02 48.27 90 top
R40  820Ω  [R0603]  50.42 17.18 0 top
R41  47Ω  [R0805]  50.4 9.15 0 top
R42  47Ω  [R0805]  50.48 6.69 0 top
SW1  TS-1187A-B-A-B  [SW-SMD_4P-L5.1-W5.1-P3.70-LS6.5-TL-2]  52.89 31.38 180 top
SW2  TS-1187A-B-A-B  [SW-SMD_4P-L5.1-W5.1-P3.70-LS6.5-TL-2]  19.44 55.24 270 top
U1  AMS1117-3.3  [SOT-223-3_L6.5-W3.4-P2.30-LS7.0-BR]  57.36 59.43 180 top
U2  DS3231MZ+TRL  [SOIC-8_L4.9-W3.9-P1.27-LS6.0-BL]  37.14 13.88 90 top
U5  RP2040  [LQFN-56_L7.0-W7.0-P0.4-EP]  36.34 35.88 0 top
U6  W25Q128JVSIQ  [SOIC-8_L5.3-W5.3-P1.27-LS8.0-BL]  36.34 46.88 270 top
U7  MCP4822-E/SN  [SOIC-8_L4.9-W3.9-P1.27-LS6.0-BL]  53.85 44.08 270 top
USB2  KH-TYPE-C-16P  [USB-C-SMD_KH-TYPE-C-16P]  69.8 57.87 90 top
X1  12MHz  [OSC-SMD_4P-L3.2-W2.5-BL]  36.93 24.48 90 top

## Footprints (pads in the part's own frame, mm; a bottom-side part is the same pattern mirrored in y, then rotated)
AUDIO-SMD_PJ-327A0-SMT
  rect 1.8x3 smd: 2(3.15,-4.028) 3(-3.75,-4.028) 4(-4.75,4.028) 5(-1.15,4.028) 6(4.75,4.028)
BAT-SMD_CR1220-2ZX
  rect 4.5x2.3 smd: 1(-8.6,0) 2(8.6,0)
C0402
  rect 0.79x0.54 smd: 1(-0.545,0) 2(0.545,0)
C0402_NEW
  rect 0.79x0.54 smd: 1(-0.545,0) 2(0.545,0)
C0603
  rect 0.8x0.9 smd: 1(-0.7,0) 2(0.7,0)
C1206
  rect 1.485x1.728 smd: 1(-1.593,0) 2(1.593,0)
CONN-TH_DS1093-01-PN60
  round 1.6 hole 1.1: 1(1.3,0.888) 2(-1.3,0.888) 3(3.4,0.888) 4(-3.4,0.888) 5(3.4,3.388) 6(-3.4,3.388)
  round 4 hole 3: 7(0,-3.388) 8(-6.85,-2.39) 9(6.85,-2.39)
DSUB-TH_15P-P2.29-H-F_DDMRH15PFE006
  round 1.8 hole 1: 1(4.58,2.54) 2(2.29,2.54) 3(0,2.54) 4(-2.29,2.54) 5(-4.58,2.54) 6(5.725,0) 7(3.435,0) 8(1.145,0) 9(-1.145,0) 10(-3.435,0) 11(4.58,-2.54) 12(2.29,-2.54) 13(0,-2.54) 14(-2.29,-2.54) 15(-4.58,-2.54)
  round 4.5 hole 3.4: 16(-12.25,0) 17(12.25,0)
HDR-TH_5P-P2.54-V-M
  rect 1.7x1.7 hole 1.1: 1(-5.08,0)
  round 1.7 hole 1.1: 2(-2.54,0) 3(0,0) 4(2.54,0) 5(5.08,0)
HDR-TH_20P-P2.54-V-M-1
  rect 1.8x1.8 hole 1.2: 1(-24.13,0)
  round 1.8 hole 1.2: 2(-21.59,0) 3(-19.05,0) 4(-16.51,0) 5(-13.97,0) 6(-11.43,0) 7(-8.89,0) 8(-6.35,0) 9(-3.81,0) 10(-1.27,0) 11(1.27,0) 12(3.81,0) 13(6.35,0) 14(8.89,0) 15(11.43,0) 16(13.97,0) 17(16.51,0) 18(19.05,0) 19(21.59,0) 20(24.13,0)
LED0805-RD
  rect 1x1.25 smd: 1(-1.1,0) 2(1.1,0)
LQFN-56_L7.0-W7.0-P0.4-EP
  rect 1.1x0.2 smd: 1(-3.55,2.6) 2(-3.55,2.2) 3(-3.55,1.8) 4(-3.55,1.4) 5(-3.55,1) 6(-3.55,0.6) 7(-3.55,0.2) 8(-3.55,-0.2) 9(-3.55,-0.6) 10(-3.55,-1) 11(-3.55,-1.4) 12(-3.55,-1.8) 13(-3.55,-2.2) 14(-3.55,-2.6) 29(3.55,-2.6) 30(3.55,-2.2) 31(3.55,-1.8) 32(3.55,-1.4) 33(3.55,-1) 34(3.55,-0.6) 35(3.55,-0.2) 36(3.55,0.2) 37(3.55,0.6) 38(3.55,1) 39(3.55,1.4) 40(3.55,1.8) 41(3.55,2.2) 42(3.55,2.6)
  rect 0.2x1.1 smd: 15(-2.6,-3.55) 16(-2.2,-3.55) 17(-1.8,-3.55) 18(-1.4,-3.55) 19(-1,-3.55) 20(-0.6,-3.55) 21(-0.2,-3.55) 22(0.2,-3.55) 23(0.6,-3.55) 24(1,-3.55) 25(1.4,-3.55) 26(1.8,-3.55) 27(2.2,-3.55) 28(2.6,-3.55) 43(2.6,3.55) 44(2.2,3.55) 45(1.8,3.55) 46(1.4,3.55) 47(1,3.55) 48(0.6,3.55) 49(0.2,3.55) 50(-0.2,3.55) 51(-0.6,3.55) 52(-1,3.55) 53(-1.4,3.55) 54(-1.8,3.55) 55(-2.2,3.55) 56(-2.6,3.55)
  rect 3.1x3.1 smd: 57(0,0)
OSC-SMD_4P-L3.2-W2.5-BL
  rect 1.4x1.2 smd: 1(-1.1,-0.875) 2(1.1,-0.875) 3(1.1,0.875) 4(-1.1,0.875)
R0402
  rect 0.566x0.54 smd: 1(-0.433,0) 2(0.433,0)
R0603
  rect 0.806x0.864 smd: 1(-0.753,0) 2(0.753,0)
R0805
  rect 1.133x1.377 smd: 1(-1,0) 2(1,0)
SOIC-8_L4.9-W3.9-P1.27-LS6.0-BL
  oval 0.588x2.045 smd: 1(-1.905,-2.772) 2(-0.635,-2.772) 3(0.635,-2.772) 4(1.905,-2.772) 5(1.905,2.772) 6(0.635,2.772) 7(-0.635,2.772) 8(-1.905,2.772)
SOIC-8_L5.3-W5.3-P1.27-LS8.0-BL
  oval 0.63x2.25 smd: 1(-1.905,-3.53) 2(-0.635,-3.53) 3(0.635,-3.53) 4(1.905,-3.53) 5(1.905,3.53) 6(0.635,3.53) 7(-0.635,3.53) 8(-1.905,3.53)
SOT-23-3_L2.9-W1.6-P1.90-LS2.8-BR
  rect 1.07x0.6 smd: 1(1.235,-0.95) 2(1.235,0.95) 3(-1.235,0)
SOT-223-3_L6.5-W3.4-P2.30-LS7.0-BR
  rect 2.5x1.1 smd: 1(2.97,-2.3) 2(2.97,0) 3(2.97,2.3)
  rect 2.34x3.6 smd: 4(-2.97,0)
SW-SMD_4P-L5.1-W5.1-P3.70-LS6.5-TL-2
  rect 1.7x1 smd: 1(-3.3,1.85) 2(3.3,1.85) 3(-3.3,-1.85) 4(3.3,-1.85)
TF-SMD_TF-PUSH
  rect 0.7x1.6 smd: 1(2.25,5.3) 2(1.15,5.3) 3(0.05,5.3) 4(-1.05,5.3) 5(-2.15,5.3) 6(-3.25,5.3) 7(-4.35,5.3) 8(-5.45,5.3) CD(-6.55,5.3)
  rect 1.2x1.5 smd: 10(-7.75,4.3)
  rect 1.2x2.2 smd: 11(-7.75,-5.3) 12(7.75,-5.3)
  rect 1.6x1.5 smd: 13(6.85,4.3)
USB-C-SMD_KH-TYPE-C-16P
  oval 1.2x2 hole 0.7x1.7: 1(-4.32,1.765) 2(4.32,1.765)
  oval 1.2x1.8 hole 0.7x1.4: 3(-4.32,-2.415) 4(4.32,-2.415)
  rect 0.3x1.3 smd: A1(-3.35,2.415) A4(-2.55,2.415) A5(-1.25,2.415) A6(-0.25,2.415) A7(0.25,2.415) A8(1.25,2.415) A9(2.55,2.415) A12(3.35,2.415) B1(3.05,2.415) B4(2.25,2.415) B5(1.75,2.415) B6(0.75,2.415) B7(-0.75,2.415) B8(-1.75,2.415) B9(-2.25,2.415) B12(-3.05,2.415)

## Nets
As in the schematic.

Pads without a net: CARD2 1 8 CD; DSUB1 4 9 11 12 15; J2 4; PS1 2 6; U2 1 3; U5 24 25; USB2 A8 B8

## Via types
v1: diameter 0.61, hole 0.305, Top Layer to Bottom Layer, 14 vias
v2: diameter 1.016, hole 0.635, Top Layer to Bottom Layer, 31 vias
v3: diameter 1.016, hole 0.66, Top Layer to Bottom Layer, 1 via
v4: diameter 0.762, hole 0.305, Top Layer to Bottom Layer, 1 via

## Routing (per net, layer and track width the routed paths; a pad name or vN(x,y) marks a point on that pad's centre or on a via; arc(x,y) is an arc through that point)
1V1: length 19.3
  Top Layer w0.203: v2(38.16,38.16) 38.14,38.17 U5.45 38.14,41.08 C21.1 ; v2(35.99,38.23) 36.14,38.38 U5.50 36.14,40.52 35.1,41.56 35.1,42.08 C13.1 ; v2(36.96,33.61) 36.94,33.59 U5.23 36.94,31.22 37.37,30.79 37.37,30.22 37.39,30.2
  Bottom Layer w0.381: v2(36.96,33.61) 38.16,34.81 v2(38.16,38.16)
  Bottom Layer w0.508: v2(35.99,38.23) 36.58,37.65 37.64,37.65 v2(38.16,38.16)
+5V: length 105.7
  Top Layer w0.203: 67.39,60.42 67.39,60.12 ; USB2.B9 USB2.A4 ; 63.47,58.19 63.28,57.99
  Top Layer w0.305: 67.39,60.12 68.24,60.12 68.87,59.5 v2(68.87,59.37) ; v2(68.87,56.22) 68.27,55.62 USB2.B9
  Top Layer w0.508: 15.34,45.3 16.77,45.3 18.17,46.69 18.17,47.81 12.71,53.27 12.71,58.33 ; 15.34,45.3 15.34,44.22 ; 15.34,45.3 15.34,46.25 ; 67.39,60.26 67.36,60.28 64.24,60.28 63.1,59.14 63.1,57.81 ; 63.1,57.81 C25.2 ; 63.1,57.81 62.29,56.98 47.31,56.98 J2.1 ; 63.1,57.81 63.47,58.19 ; J2.1 J2.2 ; J2.1 45.24,63.41 43.08,65.57 19.95,65.57 12.71,58.33 ; 12.71,58.33 PS1.4
  Bottom Layer w0.762: v2(68.87,56.22) v2(68.87,59.37)
GND: length 305.3
  Top Layer w0.203: v2(35.34,33.61) 35.34,33.61 U5.19 ; USB2.B1 USB2.A12 ; 4.96,12.7 8.7,12.7 ; USB2.A1 USB2.B12 ; v1(43.54,38.81) 42.96,38.81 C9.1
  Top Layer w0.305: X1.4 36.05,23.56 37.8,25.31 X1.2
  Top Layer w0.381: C19.1 48.54,23.44 48.53,23.43 ; J2.3 43.16,47.75 43.16,44.99 41.25,43.08 40.14,43.08 C20.1 C21.2
  Top Layer w0.399: SW1.3 SW1.4
  Top Layer w0.406: U2.5 31.99,15.79 v2(31.98,15.78) ; v1(28.68,30.77) 28.98,31.07 28.98,32.23 29.39,32.63 29.39,34.33 C11.1 ; v2(31.07,41.39) 31.07,40.69 31.45,40.31
  Top Layer w0.508: C25.1 64.58,54.27 ; C25.1 60.88,54.27 v2(60.86,54.29) 60.47,54.69 53.98,54.69 ; C25.1 63.1,55.08 65.49,57.47 ; 64.58,54.27 64.58,53.78 R33.1 ; 64.58,54.27 65.11,54.27 65.13,54.3 65.57,54.3 65.89,54.62 67.38,54.62 67.39,54.63 ; 36.12,29.11 37.91,29.11 v2(39.43,27.59) 39.43,25.13 ; U1.1 66.07,61.73 66.76,61.05 67.39,61.05 ; v2(32.52,43.82) 32.81,44.12 U6.4 ; v2(34.5,21.78) 34.51,21.77 36.05,21.77 ; 36.05,21.77 X1.4 35.19,23.38 C3.1 ; 36.05,21.77 36.05,18.03 C18.1 ; v2(47.48,63) 49.24,63 C26.1 ; v2(17.4,38.46) 17.4,36.81 17.44,36.76 21.93,36.76 22.99,35.7 C15.2 22.99,33.53 C27.2 ; U7.5 55.4,42.17 54.92,42.65 54.92,44.71 ; CARD2.12 13.31,21.27 CARD2.13 ; C8.1 42.21,31.79 v2(42.8,31.2) ; 54.92,44.71 54.92,48.93 55.68,49.69 56.51,49.69 C1.2 57.65,48.62 59.18,48.62 61.82,51.27 71.89,51.27 v2(72.27,51.65) 72.28,51.64 CN1.3 ; 54.92,44.71 U7.7 ; C13.2 C5.1 ; C5.1 C6.1 ; C5.1 36.14,43.97 36.37,44.2 ; LED1.1 1.84,37.6 2.59,36.85 ; 17.59,58.54 17.59,51.94 19.7,49.83 J1.3 ; 37.57,59.29 37.49,59.2 C12.1 ; CARD2.6 16.51,32.27 17.07,32.83 17.07,36.68 16.99,36.76 ; DSUB1.17 59.43,39.18 59.43,40.75
  Top Layer w0.762: H1.1 41.52,60.41 40.4,59.29 28.45,59.29 27.08,60.66 18.63,60.66 17.59,59.62 17.59,58.54 ; 58.83,33.38 58.68,33.23 SW1.3 ; 58.83,33.38 58.83,29.07 53.19,23.43 46.25,23.43 J2.13 ; 58.83,33.38 60.1,34.65 63.2,34.65 DSUB1.17 ; C26.1 50.54,61.71 54.36,61.71 U1.1 ; 17.44,36.76 CARD2.10 CARD2.11 2.68,36.76 2.59,36.85 2.59,23.56 4.85,21.3 4.85,12.81 4.96,12.7 ; CN1.4 73.28,48.21 CN1.3
  Top Layer w1.016: v2(34.19,35.87) 34.21,35.88 U5.57
  Bottom Layer w0.203: 44.09,39.74 43.97,39.62 43.97,38.41
  Bottom Layer w0.406: v2(31.98,15.78) 32.21,16.01 32.21,16.03
  Bottom Layer w1.016: v2(34.19,35.87) 34.19,35.9
  vias: v2(36.35,44.26)
VCC: length 228.5
  Top Layer w0.203: 36.12,41.25 v2(36.75,41.25) 37.34,41.25 37.35,41.25 ; U5.1 32.18,38.48 C7.2 ; C9.2 41.2,38.48 39.89,38.48 ; 37.35,41.25 37.35,40.6 36.94,40.2 U5.48 ; 37.35,41.25 37.35,41.94 C6.2 ; 40.06,41.57 C20.2 ; U5.49 36.54,40.62 36.12,41.04 36.12,42.12 C5.2 ; U5.44 38.54,40.15 39.17,40.77 39.8,40.77 40.06,41.02 ; 42.34,34.33 41.79,34.88 39.19,34.88 38.69,34.38 38.69,33.59 ; 30.82,34.67 31.03,34.88 U5.10 ; 36.12,30.2 36.54,30.61 U5.22 ; 40.61,39.43 39.2,39.43 39.19,39.43 U5.43
  Top Layer w0.305: C10.2 35.7,30.12 35.08,29.5 v3(35.08,28.81)
  Top Layer w0.399: 37.9,13.21 37.9,14.58 39.1,15.79 39.26,15.79 ; 37.9,13.21 R11.2 R12.2 ; 37.9,13.21 39.88,13.21 U2.2 ; 39.26,15.79 U2.4 ; 39.26,15.79 37.9,17.15
  Top Layer w0.406: Q2.1 21.29,46.33 R26.2 ; Q1.1 19.75,42.21 R24.2 ; v2(51.33,25.56) 49.75,25.56 R28.2 ; C7.2 32.16,39.22 32.36,39.42 v2(32.61,39.42) ; v1(30.33,33.87) 30.36,33.87 30.82,34.33 30.82,34.67
  Top Layer w0.508: R23.2 C12.2 36.4,49 v2(36.63,48.77) 36.65,48.79 39.87,48.79 ; C18.2 37.64,17.53 v2(37.64,18.55) ; R26.2 21.39,45.47 v2(21.49,45.37) ; C22.2 41.42,41.58 C20.2 ; v2(40.62,39.42) 41.05,38.98 C9.2 ; Q2.1 19.58,46.28 18.67,45.37 18.67,42.64 19.18,42.13 Q1.1 ; R6.1 48.33,46.51 46.61,44.79 45.28,44.79 J2.5
  Top Layer w0.762: v2(47.55,58.96) 47.62,58.9 C26.2 50.68,59.43 U1.2 U1.4 ; 40.06,41.57 40.06,40.32 40.62,39.77 v2(40.62,39.42) ; R29.1 23.57,29.86 v2(23.57,28.1)
  Bottom Layer w0.305: 46.18,18.04 44.86,18.04 ; 25.89,35.9 29.52,35.9
  Bottom Layer w0.406: 44.86,18.04 43.87,18.04 ; v1(30.33,33.87) 29.99,33.87 29.82,34.04
  Bottom Layer w0.508: v3(35.08,28.81) 35.08,29.98 38.69,33.59 39.2,33.59 39.81,34.2 39.81,38.62 v2(40.62,39.42) ; v2(37.64,18.55) 43.36,18.55 43.87,18.04 ; v2(32.61,39.42) 32.55,39.42 32.47,39.51 ; v2(23.57,28.1) 25.89,30.41 25.89,40.97 v2(21.49,45.37)
  Bottom Layer w0.762: J2.5 44.72,44.75 40.67,48.8 36.66,48.8 v2(36.63,48.77) ; J2.5 47.55,47.07 v2(47.55,58.96) ; J2.5 J2.6 46.71,42.21 51.33,37.6 51.33,36.12 51.23,36.02 51.23,25.66 v2(51.33,25.56) 51.33,23.19 46.18,18.04 ; v2(37.64,18.55) 37.64,26.25 v3(35.08,28.81) 30.13,28.81 29.52,29.42 29.52,36.56 34.21,41.25 v2(36.75,41.25)
  vias: v2(38.66,33.59)
GP0: length 20.3
  Top Layer w0.203: U5.2 30.68,38.08 30.15,38.61 30.15,51.31 29.26,52.2 29.26,53.1 J1.1
GP1: length 18.7
  Top Layer w0.203: J1.2 28.33,52.38 29.77,50.93 29.77,38.46 30.55,37.68 U5.3
GP2: length 14.1
  Top Layer w0.203: U5.4 30.45,37.28 29.34,38.39 29.34,46.28 28.33,47.29 J1.4
GP3: length 11.5
  Top Layer w0.203: U5.5 30.34,36.88 28.98,38.25 28.98,43.22 J1.5
GP4: length 9.4
  Top Layer w0.203: U5.6 30.24,36.48 28.63,38.1 28.63,41.03 J1.6
GP5: length 7.4
  Top Layer w0.203: J1.7 27.65,39.47 27.65,38.58 30.14,36.08 U5.7
GP6: length 5.8
  Top Layer w0.203: J1.9 28.53,35.68 U5.8
GP7: length 7.5
  Top Layer w0.203: U5.9 29.24,35.28 28.6,34.64 28.6,33.21 J1.10
GP8: length 27
  Top Layer w0.203: Q1.2 20.53,44.03 21.44,43.12 21.92,43.12 25.79,39.25 25.79,31.17 J1.11 28.88,29.52 29.57,30.2 29.57,32.07 31.98,34.49 32.79,34.49 U5.11
GP9: length 38.1
  Top Layer w0.203: U5.12 32.08,34.08 29.92,31.93 29.92,28.71 28.19,26.97 J1.12 25.28,29.14 25.28,34.71 18.16,41.82 18.16,45.72 18.7,46.26 18.7,47.35 Q2.2 20.45,48.23 R26.1
GP10: length 35.5
  Top Layer w0.203: U5.13 32.18,33.68 30.28,31.78 30.28,24.64 27.53,21.89 J1.14 27.4,21.85 25.76,21.85 21.79,25.82 14.43,25.82 14.05,26.2 14.05,30.77 14.31,31.02 15.07,31.02 CARD2.5
GP11: length 33.6
  Top Layer w0.203: J1.15 28.27,19.35 30.63,21.72 30.63,28.69 32.79,30.85 U5.14 ; CARD2.3 15.29,28.89 17.63,28.89 v2(18.73,27.8)
  Bottom Layer w0.203: v2(18.73,27.8) 18.73,26.64 26.11,19.26 27.35,19.26 J1.15
GP12: length 44.5
  Top Layer w0.203: U5.15 33.74,31.29 30.99,28.54 30.99,20.36 J1.16 26.96,16.81 18.32,25.46 14.23,25.46 13.52,26.17 13.52,32.77 14.11,33.37 CARD2.7
GP13: length 41
  Top Layer w0.203: U5.16 34.14,31.19 31.34,28.39 31.34,18.18 J1.17 ; v2(17.05,27.82) 17.01,27.87 CARD2.2
  Bottom Layer w0.203: J1.17 26.73,14.27 25.76,15.24 25.76,18.3 17.05,27.01 v2(17.05,27.82)
GP14: length 36.6
  Top Layer w0.203: 35.61,13.21 36.06,13.66 36.06,16.3 31.7,20.65 31.7,28.25 34.54,31.09 U5.17
  Top Layer w0.399: R11.1 35.94,12.88 35.61,13.21 34.41,13.21 U2.7 33.36,13.25 29.39,9.28 27.52,9.28 J1.19
GP15: length 43.5
  Top Layer w0.203: U5.18 34.94,30.99 32.06,28.1 32.06,20.83 37.01,15.88 37.01,7.37 36.5,6.86 36.12,6.86 R12.1
  Top Layer w0.399: 34.24,6.66 34.37,6.78 U2.8 ; 34.24,6.66 35.91,6.66 R12.1 ; 34.24,6.66 J1.20
GP16: length 33.3
  Top Layer w0.203: U5.27 38.54,31.17 41.83,27.88 41.83,9.02 44.2,6.66 J2.20 49.44,6.66 R42.1
GP17: length 30.4
  Top Layer w0.203: U5.28 38.94,31.38 42.19,28.13 42.19,11.46 44.45,9.19 J2.19 49.36,9.19 R41.1
GP18: length 26.5
  Top Layer w0.203: R13.1 46.25,15.28 J2.17 44.56,14.27 42.55,16.29 42.55,28.36 39.89,31.01 39.89,33.28
GP19: length 24.6
  Top Layer w0.203: 39.89,33.68 40.59,33.68 40.82,33.46 40.82,30.67 42.9,28.59 42.9,18.24 44.33,16.81 J2.16 45.51,17.08 49.69,17.08
GP20: length 22.7
  Top Layer w0.203: 39.89,34.08 40.7,34.08 41.17,33.61 41.17,30.88 43.26,28.79 43.26,20.29 44.19,19.35 J2.15 45.71,18.88 R15.1
GP21: length 21
  Top Layer w0.203: R14.1 46.35,20.78 J2.14 44.19,21.89 43.61,22.47 43.61,29 41.58,31.03 41.58,33.91 41.01,34.48 39.89,34.48
GP22: length 31.3
  Top Layer w0.203: U7.3 52.23,43.44 52.86,42.81 52.86,39.44 47.83,34.41 47.83,32.9 45.62,30.69 44.66,30.69 ; 39.89,35.28 42.62,35.28 43.08,34.83 43.08,32.35 44.66,30.77 44.66,30.69 ; 44.66,30.69 44.09,30.12 44.09,27.18 44.29,26.97 J2.12
GP23: length 68.8
  Top Layer w0.203: v1(49.36,52.36) 49.38,52.33 49.38,46.64 47.86,45.12 47.86,44.15 49.89,42.12 51.03,42.12 U7.4 ; 39.89,35.68 41.96,35.68 v1(42.22,35.94) ; H1.2 38.98,62.38 39.83,63.23 44.2,63.23 v1(44.25,63.18)
  Bottom Layer w0.203: v1(49.36,52.36) 49.36,59.34 47.28,61.42 46.01,61.42 v1(44.25,63.18) ; H1.2 38.98,60.27 34.61,55.9 34.61,47.92 36.02,46.51 38.27,46.51 42.96,41.83 42.96,39.4 42.17,38.6 42.17,36 v1(42.22,35.94)
  Bottom Layer w0.508: 39.68,61.42 39.68,61.48 H1.2
GP24: length 66.3
  Top Layer w0.203: H1.3 36.44,63.32 37.24,64.12 v1(41.81,64.12) ; 39.89,36.08 41.19,36.08 v1(41.4,36.3)
  Top Layer w0.305: v2(48.7,44.69) 48.72,44.71 U7.2
  Bottom Layer w0.203: H1.3 36.44,60.8 34.26,58.62 34.26,47.77 35.87,46.16 38.12,46.16 42.6,41.68 42.6,39.54 41.78,38.73 41.78,36.68 v1(41.4,36.3) ; v2(48.7,44.69) 48.62,44.76 48.62,59.27 46.95,60.94 45.52,60.94 42.35,64.12 v1(41.81,64.12)
GP25: length 68
  Top Layer w0.203: R3.1 11.42,40.98 v1(11.61,41.18) ; 39.89,36.48 38.92,36.48 v1(38.91,36.48)
  Bottom Layer w0.203: v1(38.91,36.48) 39.15,36.71 39.15,39.05 40.29,40.19 41,40.19 41.34,39.86 42.02,39.86 42.22,40.06 42.22,41.56 37.98,45.8 35.72,45.8 33.9,47.62 H1.4 30.11,57.69 25.12,57.69 11.61,44.17 v1(11.61,41.18)
GP26: length 8.9
  Top Layer w0.203: J2.10 44.45,32.05 43.49,33.02 43.49,35.69 42.29,36.88 39.89,36.88
GP27: length 6.5
  Top Layer w0.203: 39.89,37.28 42.55,37.28 J2.9
GP28: length 6.6
  Top Layer w0.203: J2.7 45.04,39.47 45.04,38.69 44.03,37.68 39.89,37.68
GP29: length 45.3
  Top Layer w0.203: 39.89,38.08 43.62,38.08 44.1,38.56 44.1,39.05 43.74,39.41 43.74,42.46 v4(43.11,43.09)
  Bottom Layer w0.203: H1.5 32.52,62.65 39.75,62.65 40.18,62.21 40.18,59.97 34.97,54.76 34.97,48.06 36.17,46.87 39.33,46.87 v4(43.11,43.09)
HSYNC: length 28.3
  Top Layer w0.203: DSUB1.13 68.56,20.34 68.56,17.1 65.44,13.98 58.48,13.98 51.48,6.98 R42.2
RUN: length 24.8
  Top Layer w0.203: U5.26 38.14,30.62 v1(38.41,30.36)
  Top Layer w0.399: J2.11 v1(45.26,29.53) SW1.2 50.17,29.53 ; 48.54,26.53 49.63,26.53 49.74,26.42 49.74,29.11 50.17,29.53 ; 50.17,29.53 SW1.1
  Bottom Layer w0.203: v1(38.41,30.36) 39.23,29.53 v1(45.26,29.53)
SD-VCC: length 11.8
  Top Layer w0.508: 21.32,30.11 15.25,30.11 CARD2.4 ; 21.32,30.11 R29.2 ; 21.32,30.11 20.85,30.58 C27.1 20.85,33.94 C15.1
USB-DM: length 39.2
  Top Layer w0.203: USB2.A7 67.39,58.12 66.5,58.12 66.3,57.92 66.3,57.31 66.49,57.12 USB2.B7 69.35,57.12 69.78,56.69 69.78,53.3 69.04,52.56 60.99,52.56 60.13,53.43 48.6,53.43 46.28,51.11 44.66,51.11 42.57,49.02 R39.2
USB-DP: length 46.1
  Top Layer w0.203: 68.46,57.62 69.62,57.62 70.14,57.1 70.14,52.97 69.34,52.18 60.58,52.18 59.82,52.94 48.88,52.94 47,51.06 47,46.85 46.26,46.11 44.74,46.11 43.8,45.17 43.8,44.88 42.42,43.51 42.42,42.32 R38.2 ; 68.46,57.62 68.46,58.35 68.19,58.62 USB2.B6 ; 68.46,57.62 67.05,57.62
VSYNC: length 23.5
  Top Layer w0.203: R41.2 57.44,15.2 65.54,15.2 67.7,17.36 67.7,18.92 DSUB1.14
$1N15506: length 11.8
  Top Layer w0.203: U5.46 37.74,43.41 37.97,43.64 41.17,43.64 42.09,44.56 42.09,47.44 42.02,47.52
$1N15528: length 8
  Top Layer w0.203: U5.47 37.34,38.69 v1(37.01,38.36)
  Top Layer w0.305: v1(41.59,40.57) 42.84,40.57 42.86,40.59
  Bottom Layer w0.203: v1(41.59,40.57) 39.22,40.57 v1(37.01,38.36)
$1N16226: length 14.2
  Top Layer w0.203: 51.2,17.08 R15.2 52.84,18.88 59.03,25.07 DSUB1.2
$1N16303: length 12.9
  Top Layer w0.203: DSUB1.3 58.7,22.78 R13.2
$1N16324: length 12.6
  Top Layer w0.203: DSUB1.1 59.42,27.36 52.84,20.78 R14.2
$1N17160: length 16.4
  Top Layer w0.203: 39.87,46.25 41.15,46.25 41.35,46.05 41.35,44.84 40.92,44.41 38.58,44.41 37.56,45.42 35.51,45.42 33.99,43.9 33.99,41.67 35.34,40.31 U5.52
$1N17190: length 17.4
  Top Layer w0.203: 39.87,47.52 39.89,47.5 40.4,47.5 41.71,46.2 41.71,44.7 41.07,44.06 38.3,44.06 37.28,45.07 35.66,45.07 34.34,43.75 34.34,41.82 35.74,40.42 U5.51
$1N17220: length 9.3
  Top Layer w0.203: U5.54 34.54,40.08 31.42,43.2 31.42,45.85 31.82,46.25 U6.3
$1N17286: length 10.9
  Top Layer w0.152: U6.2 32.79,47.5 31.42,47.5 31.09,47.17 31.09,43.06 34.14,40.01 U5.55
$1N17350: length 16.1
  Top Layer w0.152: U5.56 33.74,39.98 30.79,42.93 30.79,48.01 31.57,48.79 U6.1
  Top Layer w0.203: U6.1 32.41,49.19 R23.1 32.1,51 R4.1
$1N17556: length 12.4
  Top Layer w0.203: 39.87,44.98 38.63,44.98 37.83,45.78 35.36,45.78 33.63,44.05 33.63,41.52 34.94,40.21 U5.53
$1N17761: length 7.2
  Top Layer w0.203: R5.2 36.26,27.49 35.11,27.49 34.17,28.43 34.17,29.19 36.14,31.17 U5.21
$1N17798: length 6.5
  Top Layer w0.203: X1.1 38.73,23.38 ; 38.73,23.38 C4.2 ; 38.73,23.38 38.73,26.58 R5.1
$1N18648: length 10.3
  Top Layer w0.203: C3.2 35.71,25.24 X1.3 36.05,25.87 33.81,28.11 33.81,29.35 35.74,31.28 U5.20
$1N19413: length 19.6
  Top Layer w0.203: R4.2 30.66,52.55 30.66,54.29 26.41,58.54 SW2.1 SW2.2
$1N20967: length 9.4
  Top Layer w0.203: Q2.3 15.51,47.28 R27.1 12.58,49.88 PS1.1
$1N21008: length 8.2
  Top Layer w0.203: PS1.5 11.61,47.64 11.61,46.8 15.06,43.35 R25.1 15.61,43.08 Q1.3
$1N25166: length 4.2
  Top Layer w0.203: 4.04,40.98 R3.2
$1N34038: length 13.1
  Top Layer w0.203: BT1.1 23.1,12.58 23.55,13.04 31.71,13.04 33.2,14.52 U2.6
$1N89274: length 2.2
  Top Layer w0.203: USB2.B5 66.13,59.62 65.49,58.98
$1N89558: length 2.2
  Top Layer w0.203: 65.51,55.83 66.3,56.62 USB2.A5
$1N90266: length 19.1
  Top Layer w0.508: R33.2 67.66,53.17 USB2.1
  Top Layer w0.762: USB2.3 USB2.4 USB2.2
  Bottom Layer w0.762: USB2.1 USB2.3
$1N147884: length 10.8
  Top Layer w0.508: C1.1 55.86,51.5 C2.1 51.84,49.36 51.07,49.36 ; 51.07,49.36 R6.2 ; 51.07,49.36 51.08,49.35 U7.1
$1N151381: length 2.3
  Top Layer w0.203: 56.88,43.39 R34.1
$1N151496: length 2.3
  Top Layer w0.203: 56.88,45.93 R35.1
$1N151611: length 14.7
  Top Layer w0.203: 60.73,43.39 60.73,40.96 C16.1 62.48,38.79 69.04,38.79 69.68,39.43 CN1.5
$1N151726: length 14.6
  Top Layer w0.203: 63.71,46 63.64,45.93 R35.2 60.7,48.29 C17.1 ; 63.71,46 63.71,41.23 CN1.6 ; 63.71,46 63.71,47.54 CN1.2

## Copper pours and planes (outline as drawn; the poured copper is in the pictures)
GND on Bottom Layer: 0.17,68.38 75.01,68.38 75.01,0.92 0.17,0.92
GND on Bottom Layer: -0.02,69.96 74.61,69.96 74.61,0.16 -0.02,0.16

## Text on the board
Bottom Silkscreen Layer: GP29 | GP25 | GP24 | GP23 | GND | GP8=KBDCLK / GP9=KBDDATA / GP14=RTCSDA / GP15=RTCSCL / GP16=HSYNC / GP17=VSYNC / GP18=BLUE / GP11=SDMOSI / GP12=SDMISO / GP13=SDCS / GP22=AUDIOCLK / GP23=AUDIOSDI / GP24=AUDIOCS / GP10=SDCLK | Configuration: / OPTION SYSTEM I2C GP14,GP15 / OPTION SDCARD GP13, GP10, GP11, GP12 / OPTION KEYBOARD UK/US/BE/ES/FR/GR/IT / OPTION RTC AUTO (optional) / OPTION AUDIO SPI GP24, GP22, GP23 | GP0 / GP1 / GND / GP2 / GP3 / GP4 / GP5 / GND / GP6 / GP7 / GP8 / GP9 / GND / GP10 / GP11 / GP12 / GP13 / GND / GP14 / GP15 | VUSB / VUSB / GND / N/C / 3V3 / 3V3 / GP28 / GND / GP27 / GP26 / RUN / GP22 / GND / GP21 / GP20 / GP19 / GP18 / GND / GP17 / GP16
Top Silkscreen Layer: PicoMiteVGA V1.1a / PCB Peter Mather / MMBasic Geoff Graham & / Peter Mather | BOOT | GP0 | RESET
